# EAGLE schematic Laser_Array_Temp_Low_BRD_V2.0 (EAGLE 7.7.0)
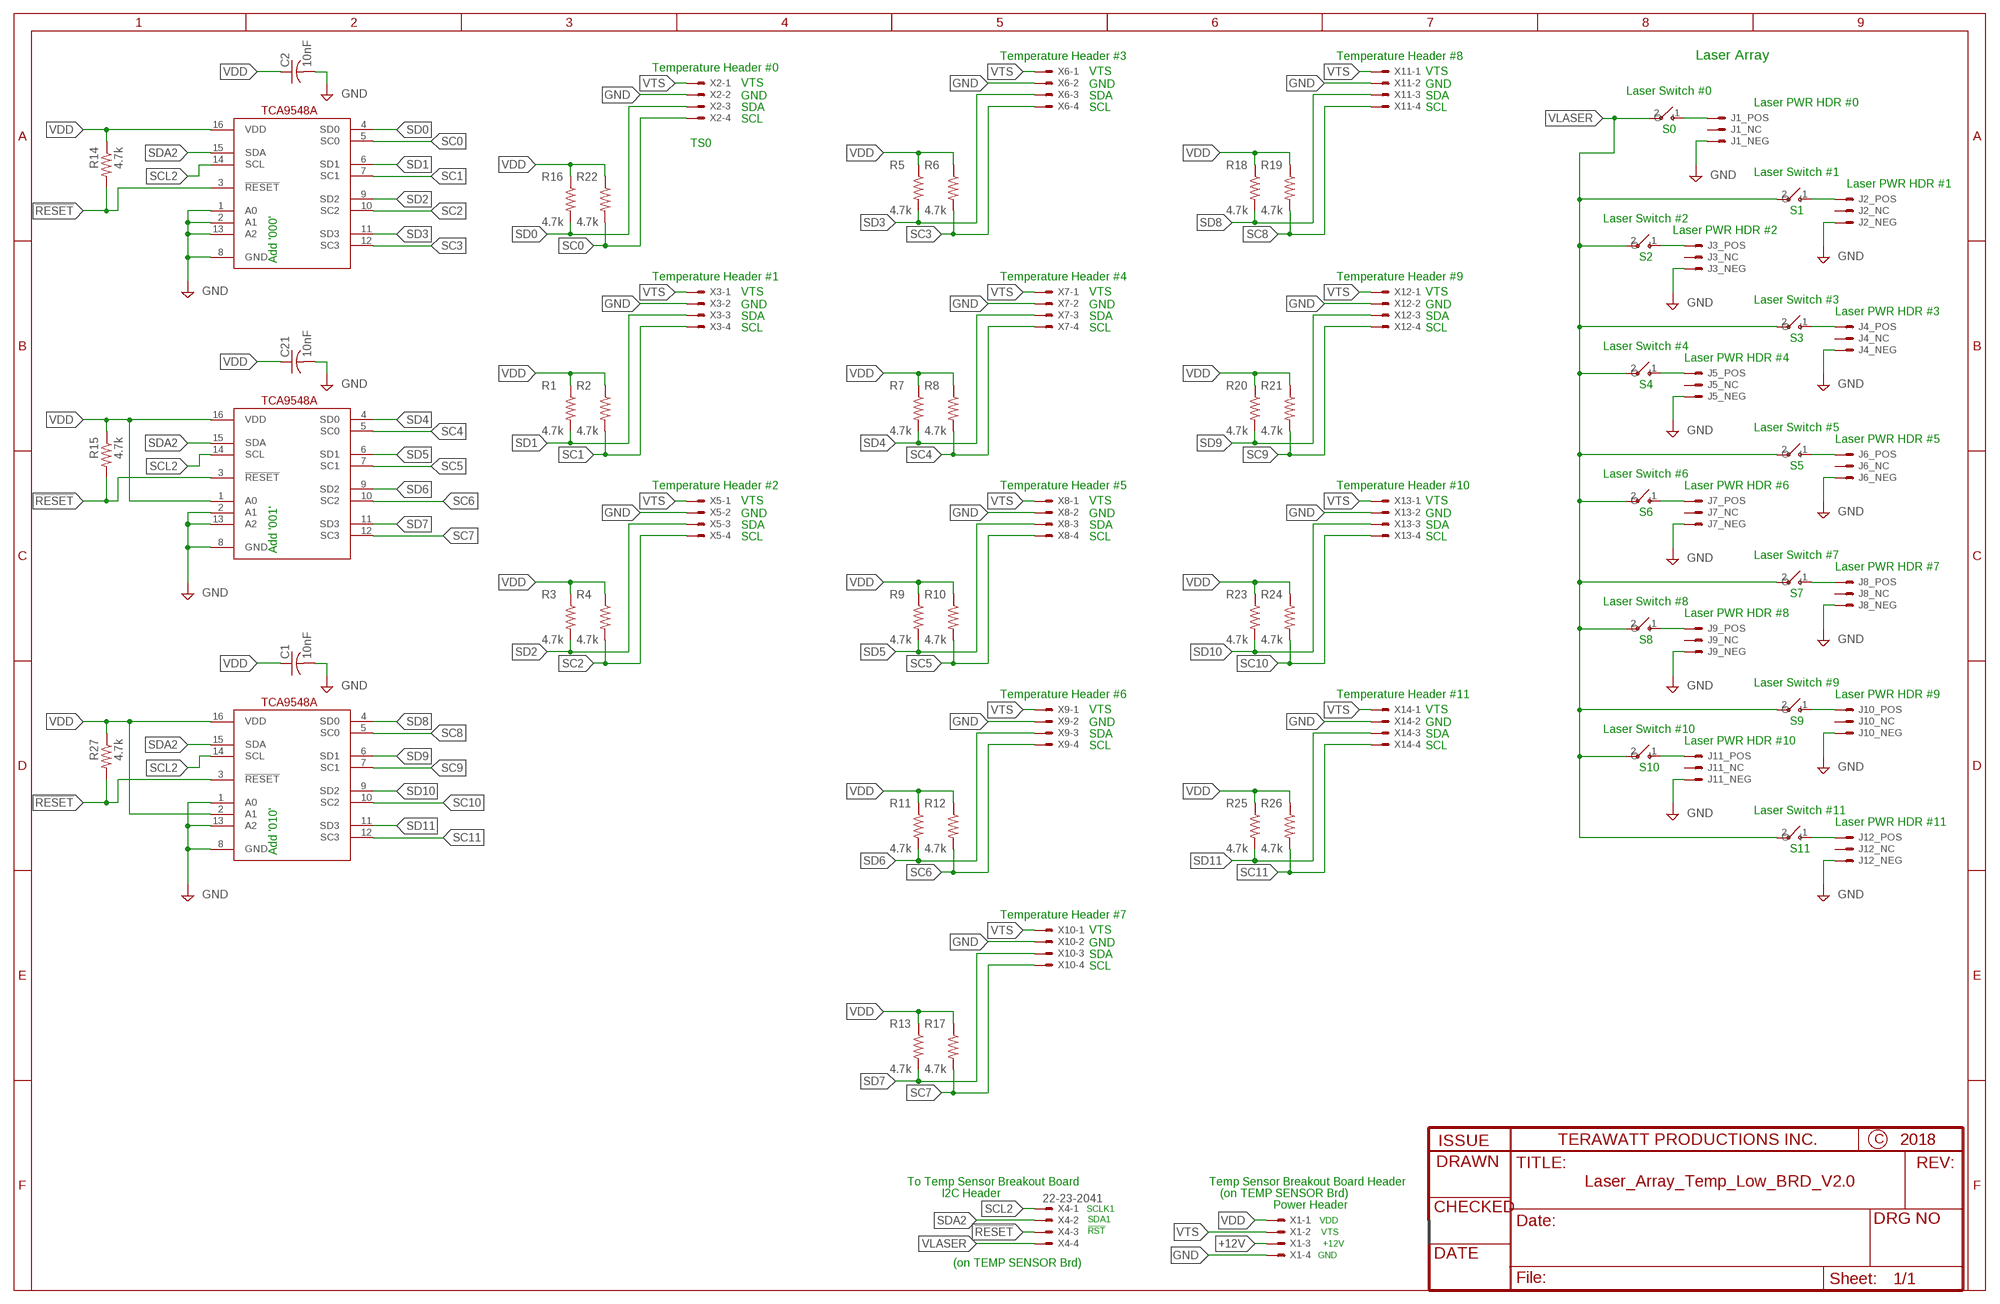
[diagram p0: schematic, sheet 1]

## Parts
C1  10nF  C-USC0805  [C0805]
C2  10nF  C-USC0805  [C0805]
C21  10nF  C-USC0805  [C0805]
J1  LASER_MOD  [LASER_MOD]
J2  LASER_MOD  [LASER_MOD]
J3  LASER_MOD  [LASER_MOD]
J4  LASER_MOD  [LASER_MOD]
J5  LASER_MOD  [LASER_MOD]
J6  LASER_MOD  [LASER_MOD]
J7  LASER_MOD  [LASER_MOD]
J8  LASER_MOD  [LASER_MOD]
J9  LASER_MOD  [LASER_MOD]
J10  LASER_MOD  [LASER_MOD]
J11  LASER_MOD  [LASER_MOD]
J12  LASER_MOD  [LASER_MOD]
R1  4.7k  R-US_M0805  [M0805]
R2  4.7k  R-US_M0805  [M0805]
R3  4.7k  R-US_M0805  [M0805]
R4  4.7k  R-US_M0805  [M0805]
R5  4.7k  R-US_M0805  [M0805]
R6  4.7k  R-US_M0805  [M0805]
R7  4.7k  R-US_M0805  [M0805]
R8  4.7k  R-US_M0805  [M0805]
R9  4.7k  R-US_M0805  [M0805]
R10  4.7k  R-US_M0805  [M0805]
R11  4.7k  R-US_M0805  [M0805]
R12  4.7k  R-US_M0805  [M0805]
R13  4.7k  R-US_M0805  [M0805]
R14  4.7k  R-US_M0805  [M0805]
R15  4.7k  R-US_M0805  [M0805]
R16  4.7k  R-US_M0805  [M0805]
R17  4.7k  R-US_M0805  [M0805]
R18  4.7k  R-US_M0805  [M0805]
R19  4.7k  R-US_M0805  [M0805]
R20  4.7k  R-US_M0805  [M0805]
R21  4.7k  R-US_M0805  [M0805]
R22  4.7k  R-US_M0805  [M0805]
R23  4.7k  R-US_M0805  [M0805]
R24  4.7k  R-US_M0805  [M0805]
R25  4.7k  R-US_M0805  [M0805]
R26  4.7k  R-US_M0805  [M0805]
R27  4.7k  R-US_M0805  [M0805]
S13  TOGGLE_SPST  [22-23-2021]
S14  TOGGLE_SPST  [22-23-2021]
S15  TOGGLE_SPST  [22-23-2021]
S16  TOGGLE_SPST  [22-23-2021]
S17  TOGGLE_SPST  [22-23-2021]
S18  TOGGLE_SPST  [22-23-2021]
S19  TOGGLE_SPST  [22-23-2021]
S20  TOGGLE_SPST  [22-23-2021]
S21  TOGGLE_SPST  [22-23-2021]
S22  TOGGLE_SPST  [22-23-2021]
S23  TOGGLE_SPST  [22-23-2021]
S24  TOGGLE_SPST  [22-23-2021]
U1  TCA9546A  [SOIC16N]
U2  TCA9546A  [SOIC16N]
U3  TCA9546A  [SOIC16N]
X1  22-23-2041  [22-23-2041]
X2  22-23-2041  [22-23-2041]
X3  22-23-2041  [22-23-2041]
X4  22-23-2041  [22-23-2041]
X5  22-23-2041  [22-23-2041]
X6  22-23-2041  [22-23-2041]
X7  22-23-2041  [22-23-2041]
X8  22-23-2041  [22-23-2041]
X9  22-23-2041  [22-23-2041]
X10  22-23-2041  [22-23-2041]
X11  22-23-2041  [22-23-2041]
X12  22-23-2041  [22-23-2041]
X13  22-23-2041  [22-23-2041]
X14  22-23-2041  [22-23-2041]

## Nets
!RESET: R14.2 R15.2 R27.2 U1.3(!RESET) U2.3(!RESET) U3.3(!RESET) X4.3
+12V: X1.3
GND: C1.2 C2.2 C21.2 J1.3 J2.3 J3.3 J4.3 J5.3 J6.3 J7.3 J8.3 J9.3 J10.3 J11.3 J12.3 U1.1(A0) U1.2(A1) U1.8(GND) U1.13(A2) U2.2(A1) U2.8(GND) U2.13(A2) U3.1(A0) U3.8(GND) U3.13(A2) X1.4 X2.2 X3.2 X5.2 X6.2 X7.2 X8.2 X9.2 X10.2 X11.2 X12.2 X13.2 X14.2
N$1: J2.1 S13.1(O)
N$2: J1.1 S16.1(O)
N$3: J3.1 S14.1(O)
N$4: J4.1 S15.1(O)
N$5: J5.1 S17.1(O)
N$6: J6.1 S18.1(O)
N$7: J7.1 S19.1(O)
N$8: J8.1 S20.1(O)
N$9: J9.1 S21.1(O)
N$10: J10.1 S22.1(O)
N$11: J11.1 S23.1(O)
N$12: J12.1 S24.1(O)
SC0: R22.2 U1.5(SC0) X2.4
SC1: R2.2 U1.7(SC1) X3.4
SC2: R4.2 U1.10(SC2) X5.4
SC3: R6.2 U1.12(SC3) X6.4
SC4: R8.2 U2.5(SC0) X7.4
SC5: R10.2 U2.7(SC1) X8.4
SC6: R12.2 U2.10(SC2) X9.4
SC7: R17.2 U2.12(SC3) X10.4
SC8: R19.2 U3.5(SC0) X11.4
SC9: R21.2 U3.7(SC1) X12.4
SC10: R24.2 U3.10(SC2) X13.4
SC11: R26.2 U3.12(SC3) X14.4
SCL2: U1.14(SCL) U2.14(SCL) U3.14(SCL) X4.1
SD0: R16.2 U1.4(SD0) X2.3
SD1: R1.2 U1.6(SD1) X3.3
SD2: R3.2 U1.9(SD2) X5.3
SD3: R5.2 U1.11(SD3) X6.3
SD4: R7.2 U2.4(SD0) X7.3
SD5: R9.2 U2.6(SD1) X8.3
SD6: R11.2 U2.9(SD2) X9.3
SD7: R13.2 U2.11(SD3) X10.3
SD8: R18.2 U3.4(SD0) X11.3
SD9: R20.2 U3.6(SD1) X12.3
SD10: R23.2 U3.9(SD2) X13.3
SD11: R25.2 U3.11(SD3) X14.3
SDA2: U1.15(SDA) U2.15(SDA) U3.15(SDA) X4.2
VDD: C1.1 C2.1 C21.1 R1.1 R2.1 R3.1 R4.1 R5.1 R6.1 R7.1 R8.1 R9.1 R10.1 R11.1 R12.1 R13.1 R14.1 R15.1 R16.1 R17.1 R18.1 R19.1 R20.1 R21.1 R22.1 R23.1 R24.1 R25.1 R26.1 R27.1 U1.16(VDD) U2.1(A0) U2.16(VDD) U3.2(A1) U3.16(VDD) X1.1
VLASER: S13.2(I) S14.2(I) S15.2(I) S16.2(I) S17.2(I) S18.2(I) S19.2(I) S20.2(I) S21.2(I) S22.2(I) S23.2(I) S24.2(I) X4.4
VTS: X1.2 X2.1 X3.1 X5.1 X6.1 X7.1 X8.1 X9.1 X10.1 X11.1 X12.1 X13.1 X14.1
Unconnected: J1.2 J2.2 J3.2 J4.2 J5.2 J6.2 J7.2 J8.2 J9.2 J10.2 J11.2 J12.2

## Notes on the sheet
- Temperature Header #3 | Temperature Header #8 | Laser Array
- Temperature Header #0
- VTS | VTS
- VTS | GND | GND
- Laser Switch #0
- GND | SDA | SDA
- Laser PWR HDR #0
- SDA | SCL | SCL
- SCL
- S0
- TS0
- Laser Switch #1
- Laser PWR HDR #1
- S1
- Laser Switch #2
- Laser PWR HDR #2
- Add '000' | S2
- Temperature Header #1 | Temperature Header #4 | Temperature Header #9
- VTS | VTS | VTS
- Laser Switch #3
- GND | GND | GND
- Laser PWR HDR #3
- SDA | SDA | SDA
- SCL | SCL | SCL
- S3
- Laser Switch #4
- Laser PWR HDR #4
- S4
- Laser Switch #5
- Laser PWR HDR #5
- S5
- Laser Switch #6
- Temperature Header #2 | Temperature Header #5 | Temperature Header #10 | Laser PWR HDR #6
- VTS | VTS | VTS
- GND | GND | GND | S6
- SDA | SDA | SDA
- SCL | SCL | SCL
- Add '001'
- Laser Switch #7
- Laser PWR HDR #7
- S7
- Laser Switch #8
- Laser PWR HDR #8
- S8
- Laser Switch #9
- Temperature Header #6 | Temperature Header #11 | Laser PWR HDR #9
- VTS | VTS
- GND | GND | S9
- Laser Switch #10
- SDA | SDA
- Laser PWR HDR #10
- SCL | SCL
- S10
- Laser Switch #11
- Laser PWR HDR #11
- Add '010' | S11
- Temperature Header #7
- VTS
- GND
- SDA
- SCL
- To Temp Sensor Breakout Board | Temp Sensor Breakout Board Header
- I2C Header | (on TEMP SENSOR Brd)
- Power Header
- SCLK1
- SDA1 | VDD
- !RST | VTS
- +12V
- GND
- (on TEMP SENSOR Brd)

## Library data of the parts
C1 C2 C21 = rcl:C-US: CAPACITOR, American symbol
J1-J12 = Mine:LASER_MOD
R1-R27 = rcl:R-US_: RESISTOR, American symbol
S13-S24 = Mine:TOGGLE_SPST: SPST Toggle SPST toggle switch with no package
U1-U3 = Mine:TCA9546A
X1-X14 = Mine:22-23-2041: .100" (2.54mm) Center Header - 4 Pin; MF: MOLEX; MPN: 22-23-2041; OC_FARNELL: 1462920; OC_NEWARK: 38C0355

## Net classes
0 default: width 0.254 mm, drill 0.508 mm, clearance 0.203 mm